# EAGLE schematic address bus display (EAGLE 9.5.1)
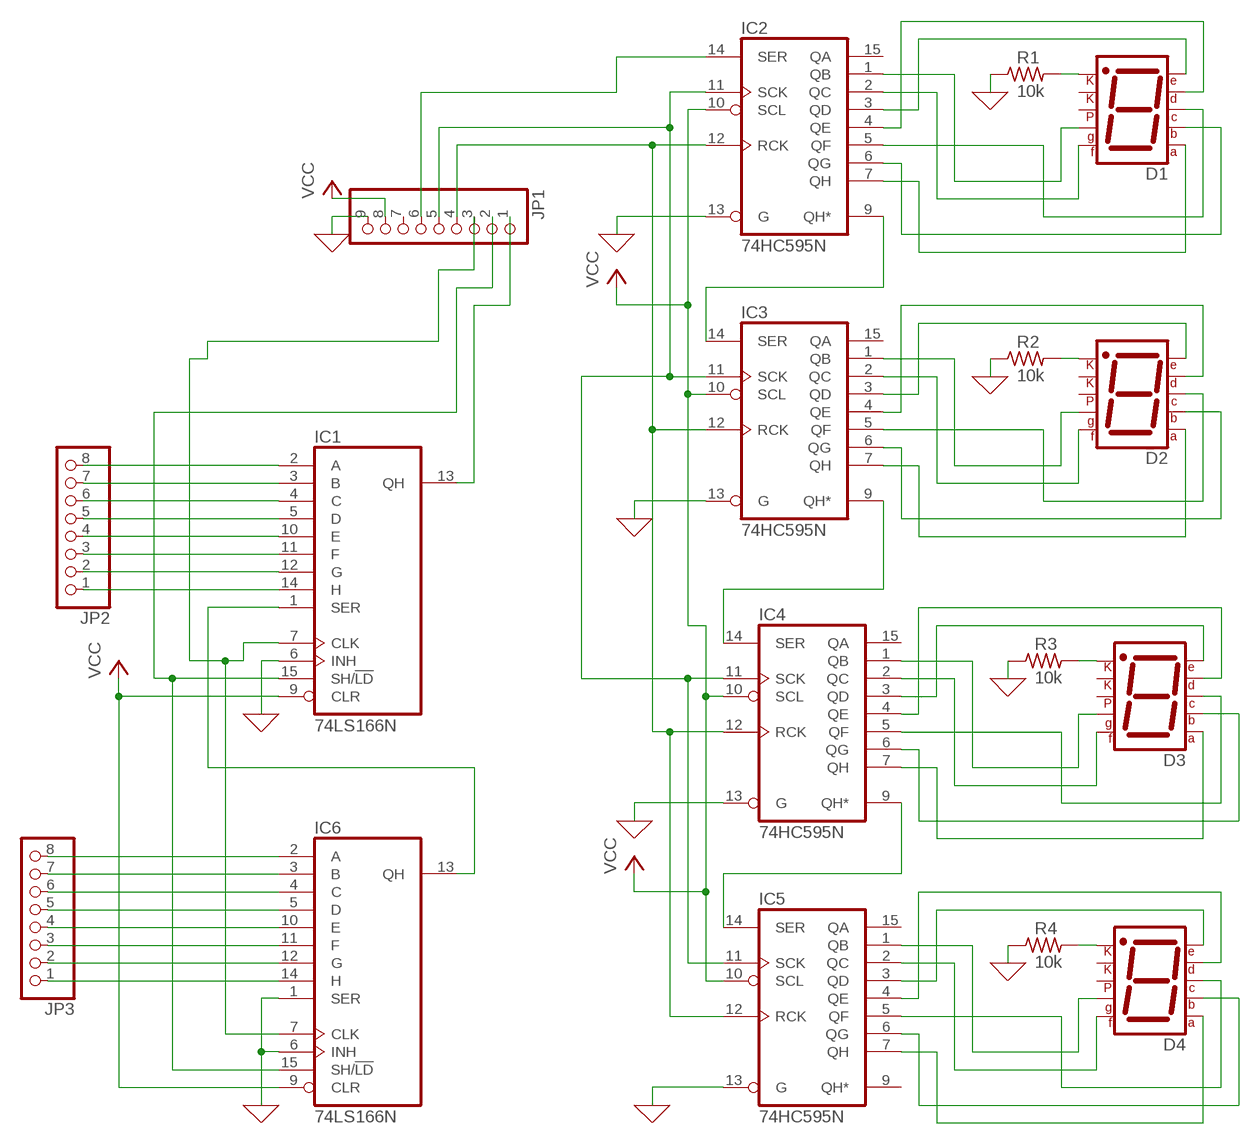
[diagram p0: schematic, sheet 1]

## Parts
D1  7SEG-CK  [7SEG-13]
D2  7SEG-CK  [7SEG-13]
D3  7SEG-CK  [7SEG-13]
D4  7SEG-CK  [7SEG-13]
IC1  74LS166N  [DIL16]
IC2  74HC595N  [DIL16]
IC3  74HC595N  [DIL16]
IC4  74HC595N  [DIL16]
IC5  74HC595N  [DIL16]
IC6  74LS166N  [DIL16]
JP1  PINHD-1X9  [1X09-BIG]
JP2  PINHD-1X8BIG  [1X08-BIG]
JP3  PINHD-1X8BIG  [1X08-BIG]
R1  10k  R-US_0204/7  [0204/7]
R2  10k  R-US_0204/7  [0204/7]
R3  10k  R-US_0204/7  [0204/7]
R4  10k  R-US_0204/7  [0204/7]

## Nets
0: IC1.6(INH) IC2.13(G) IC3.13(G) IC4.13(G) IC5.13(G) IC6.1(SER) IC6.6(INH) JP1.9 R1.1 R2.1 R3.1 R4.1 ; supply symbol labelled GND
D3: IC1.7(CLK) IC6.7(CLK) JP1.3
D4: IC1.13(QH) JP1.1
D5: IC1.15(SH/!LD) IC6.15(SH/!LD) JP1.2
D8: IC2.12(RCK) IC3.12(RCK) IC4.12(RCK) IC5.12(RCK) JP1.4
D11: IC2.14(SER) JP1.6
D12: IC2.11(SCK) IC3.11(SCK) IC4.11(SCK) IC5.11(SCK) JP1.5
N$1: D1.10(G) IC2.1(QB)
N$2: D1.9(F) IC2.2(QC)
N$3: D1.1(E) IC2.3(QD)
N$4: D1.2(D) IC2.4(QE)
N$5: D1.7(A) IC2.7(QH)
N$6: D1.6(B) IC2.6(QG)
N$7: D1.4(C) IC2.5(QF)
N$8: D1.8(CK2) R1.2
N$9: D2.10(G) IC3.1(QB)
N$10: D2.9(F) IC3.2(QC)
N$11: D2.1(E) IC3.3(QD)
N$12: D2.2(D) IC3.4(QE)
N$13: D2.6(B) IC3.6(QG)
N$14: D2.4(C) IC3.5(QF)
N$15: D2.7(A) IC3.7(QH)
N$16: D2.8(CK2) R2.2
N$17: IC2.9(QH*) IC3.14(SER)
N$18: IC1.2(A) JP2.8
N$19: IC1.3(B) JP2.7
N$20: IC1.4(C) JP2.6
N$21: IC1.5(D) JP2.5
N$22: IC1.10(E) JP2.4
N$23: IC1.11(F) JP2.3
N$24: IC1.12(G) JP2.2
N$25: IC1.14(H) JP2.1
N$26: D3.10(G) IC4.1(QB)
N$27: D3.9(F) IC4.2(QC)
N$28: D3.1(E) IC4.3(QD)
N$29: D3.2(D) IC4.4(QE)
N$30: D3.6(B) IC4.6(QG)
N$31: D3.4(C) IC4.5(QF)
N$32: D3.7(A) IC4.7(QH)
N$33: D3.8(CK2) R3.2
N$34: D4.10(G) IC5.1(QB)
N$35: D4.9(F) IC5.2(QC)
N$36: D4.1(E) IC5.3(QD)
N$37: D4.2(D) IC5.4(QE)
N$38: D4.6(B) IC5.6(QG)
N$39: D4.4(C) IC5.5(QF)
N$40: D4.7(A) IC5.7(QH)
N$41: D4.8(CK2) R4.2
N$42: IC4.9(QH*) IC5.14(SER)
N$43: IC3.9(QH*) IC4.14(SER)
N$44: IC1.1(SER) IC6.13(QH)
N$45: IC6.2(A) JP3.8
N$46: IC6.3(B) JP3.7
N$47: IC6.4(C) JP3.6
N$48: IC6.5(D) JP3.5
N$49: IC6.10(E) JP3.4
N$50: IC6.11(F) JP3.3
N$51: IC6.12(G) JP3.2
N$52: IC6.14(H) JP3.1
VCC: IC1.9(CLR) IC2.10(SCL) IC3.10(SCL) IC4.10(SCL) IC5.10(SCL) IC6.9(CLR) JP1.8
Unconnected: D1.3(CK1) D1.5(DP) D2.3(CK1) D2.5(DP) D3.3(CK1) D3.5(DP) D4.3(CK1) D4.5(DP) IC2.15(QA) IC3.15(QA) IC4.15(QA) IC5.9(QH*) IC5.15(QA) JP1.7

## Power pins joined to a net without a drawn wire
GND: IC1.8(GND) IC2.8(GND) IC3.8(GND) IC4.8(GND) IC5.8(GND) IC6.8(GND)
VCC: IC1.16(VCC) IC2.16(VCC) IC3.16(VCC) IC4.16(VCC) IC5.16(VCC) IC6.16(VCC)

## Library data of the parts
D1-D4 = special:7SEG-CK: 7-segment DISPLAY single cathode, 13 mm
IC1 = 74xx-eu:74*166: 8-bit parallel load SHIFT REGISTER
IC2-IC5 = 74xx-eu:74*595: 8-bit SHIFT REGISTER, output latch
IC6 = 74xx-us:74*166: 8-bit parallel load SHIFT REGISTER
JP1 = adafruit:PINHD-1X9: Pin header 1x10 0.1" spacing With round pins
JP2 JP3 = adafruit:PINHD-1X8: PIN HEADER
R1-R4 = adafruit:R-US_: RESISTOR, American symbol